# EAGLE design PCB (EAGLE 9.1.3)
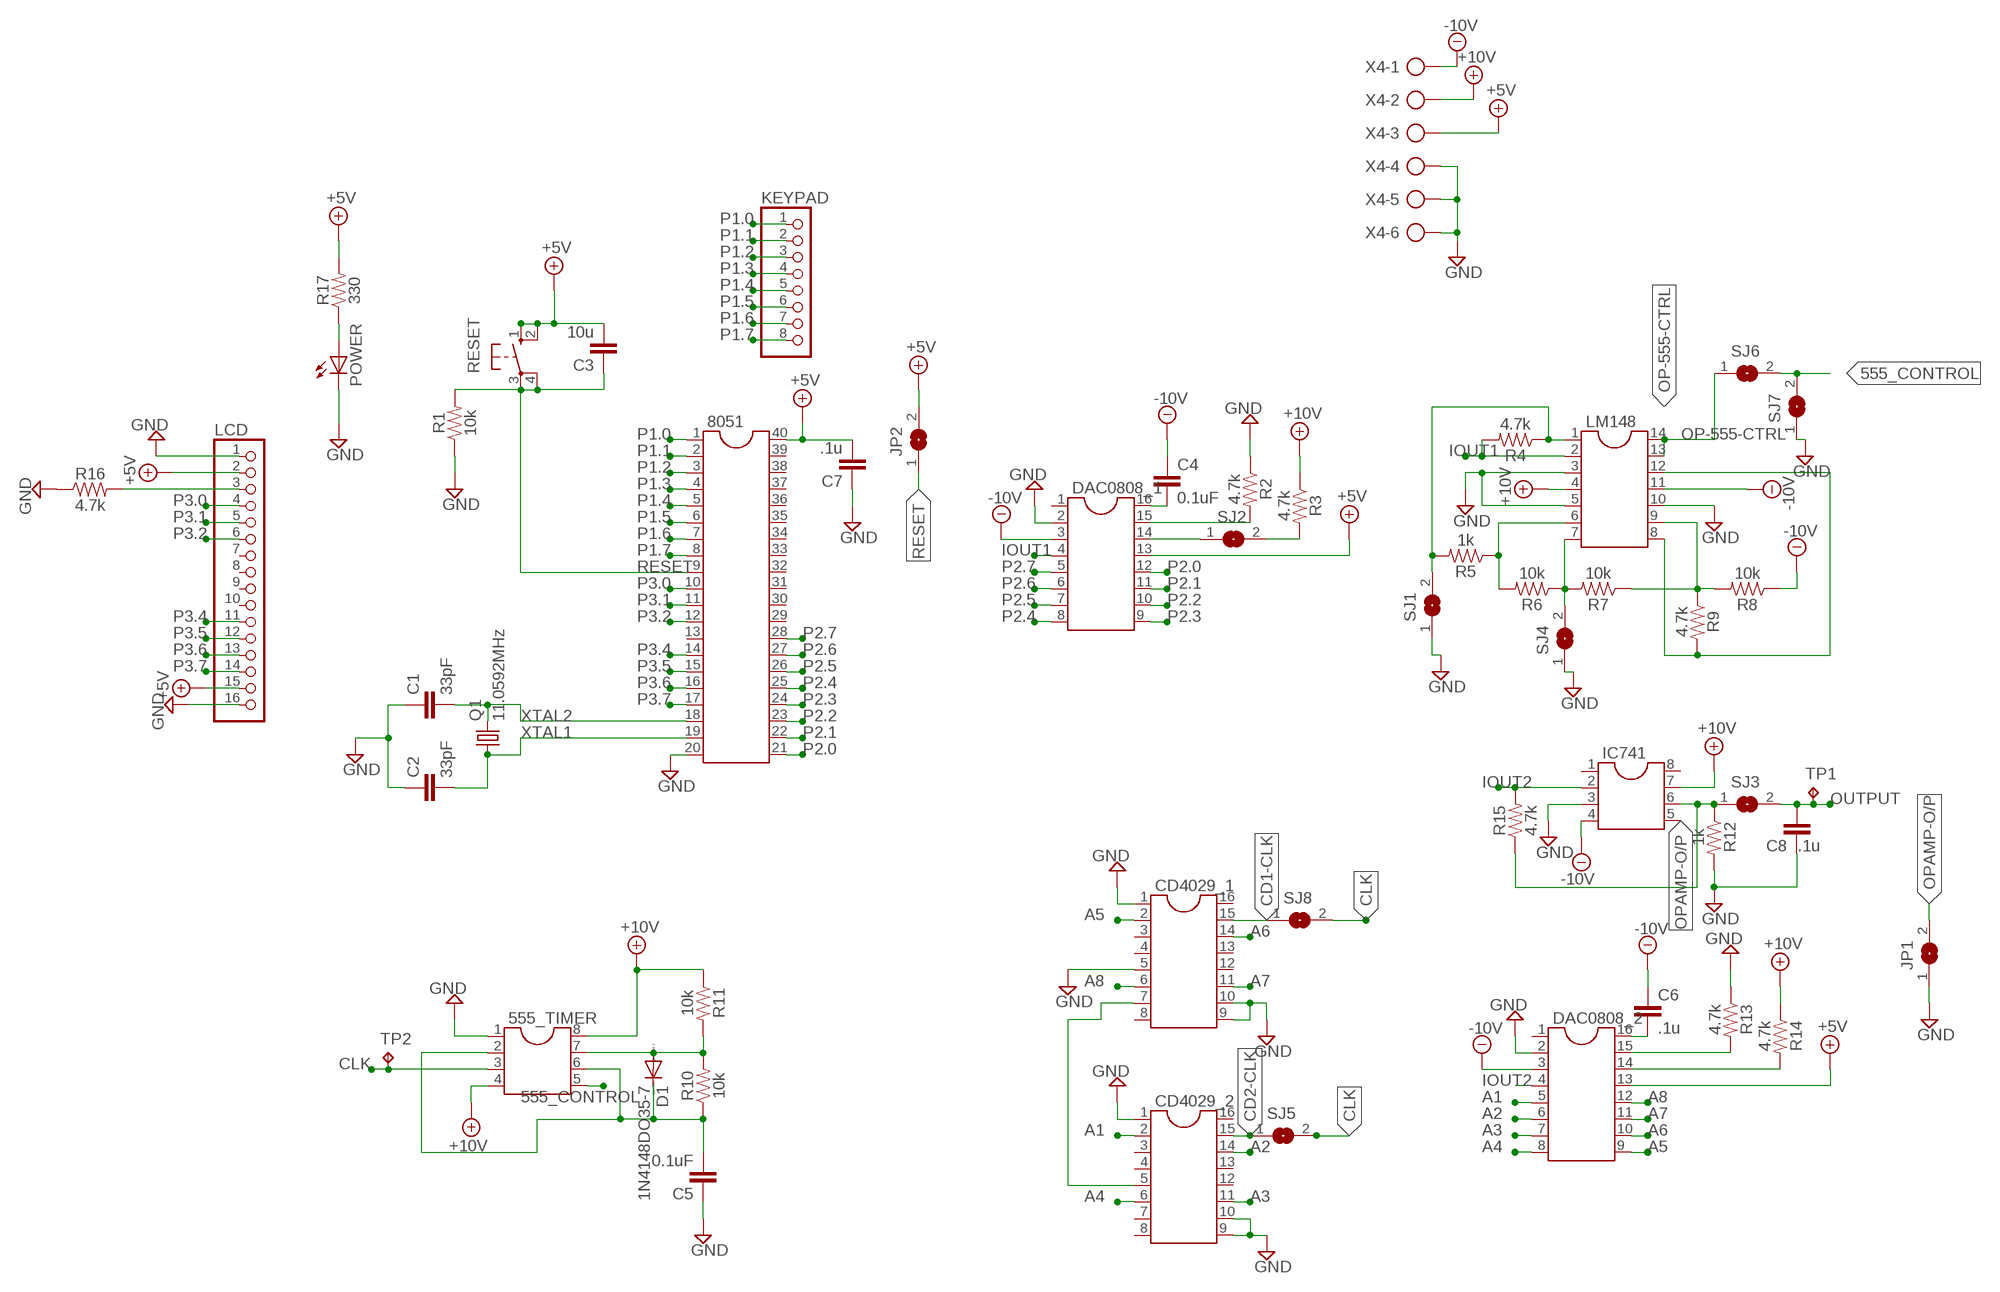
[diagram p0: schematic, sheet 1]

## Parts
555_TIMER  DIL8  [DIL08]
8051  DIL40  [DIL40]
C1  33pF  C-EU025-025X050  [C025-025X050]
C2  33pF  C-EU025-025X050  [C025-025X050]
C3  10u  C-EU025-025X050  [C025-025X050]
C4  0.1uF  C-EU025-025X050  [C025-025X050]
C5  0.1uF  C-EU025-025X050  [C025-025X050]
C6  .1u  C-EU025-025X050  [C025-025X050]
C7  .1u  C-EU025-025X050  [C025-025X050]
C8  .1u  C-EU025-025X050  [C025-025X050]
CD4029_1  DIL16  [DIL16]
CD4029_2  DIL16  [DIL16]
D1  1N4148DO35-7  [DO35-7]
DAC0808_1  DIL16  [DIL16]
DAC0808_2  DIL16  [DIL16]
IC741  DIL8  [DIL08]
JP1  SJ  [SJ]
JP2  SJ  [SJ]
KEYPAD  PINHD-1X8  [1X08]
LCD  PINHD-1X16  [1X16]
LM148  DIL14  [DIL14]
POWER  LED5MM  [LED5MM]
Q1  11.0592MHz  CRYSTALHC49S  [HC49/S]
R1  10k  RESISTORAXIAL-0.3  [AXIAL-0.3]
R2  4.7k  RESISTORAXIAL-0.3  [AXIAL-0.3]
R3  4.7k  RESISTORAXIAL-0.3  [AXIAL-0.3]
R4  4.7k  RESISTORAXIAL-0.3  [AXIAL-0.3]
R5  1k  RESISTORAXIAL-0.3  [AXIAL-0.3]
R6  10k  RESISTORAXIAL-0.3  [AXIAL-0.3]
R7  10k  RESISTORAXIAL-0.3  [AXIAL-0.3]
R8  10k  RESISTORAXIAL-0.3  [AXIAL-0.3]
R9  4.7k  RESISTORAXIAL-0.3  [AXIAL-0.3]
R10  10k  RESISTORAXIAL-0.3  [AXIAL-0.3]
R11  10k  RESISTORAXIAL-0.3  [AXIAL-0.3]
R12  1k  RESISTORAXIAL-0.3  [AXIAL-0.3]
R13  4.7k  RESISTORAXIAL-0.3  [AXIAL-0.3]
R14  4.7k  RESISTORAXIAL-0.3  [AXIAL-0.3]
R15  4.7k  RESISTORAXIAL-0.3  [AXIAL-0.3]
R16  4.7k  RESISTORAXIAL-0.3  [AXIAL-0.3]
R17  330  RESISTORAXIAL-0.3  [AXIAL-0.3]
RESET  10-XX  [B3F-10XX]
SJ1  SJ  [SJ]
SJ2  SJ  [SJ]
SJ3  SJ  [SJ]
SJ4  SJ  [SJ]
SJ5  SJ  [SJ]
SJ6  SJ  [SJ]
SJ7  SJ  [SJ]
SJ8  SJ  [SJ]
TP1  TPPAD1-20  [P1-20]
TP2  TPPAD1-20  [P1-20]
X4  AK500/6-H  [AK500/6-H]

## Nets
555_CONTROL: 555_TIMER.5 SJ6.2 SJ7.2
+5V: 8051.40 C3.2 C7.2 DAC0808_1.13 DAC0808_2.13 JP2.2 LCD.2 LCD.15 R17.P$2 RESET.1(S) RESET.2(S1) X4.3
+10V: 555_TIMER.4 555_TIMER.8 IC741.7 LM148.4 R3.P$1 R11.P$1 R14.P$1 X4.2
-10V: C4.1 C6.1 DAC0808_1.3 DAC0808_2.3 IC741.4 LM148.11 R8.P$1 X4.1
A1: CD4029_2.2 DAC0808_2.5
A2: CD4029_2.14 DAC0808_2.6
A3: CD4029_2.11 DAC0808_2.7
A4: CD4029_2.6 DAC0808_2.8
A5: CD4029_1.2 DAC0808_2.9
A6: CD4029_1.14 DAC0808_2.10
A7: CD4029_1.11 DAC0808_2.11
A8: CD4029_1.6 DAC0808_2.12
CD1-CLK: CD4029_1.15 SJ8.1
CD2-CLK: CD4029_2.15 SJ5.1
CLK: 555_TIMER.3 SJ5.2 SJ8.2 TP2.TP
GND: 555_TIMER.1 8051.20 C1.1 C2.1 C5.1 C7.1 C8.1 CD4029_1.1 CD4029_1.5 CD4029_1.9 CD4029_1.10 CD4029_2.1 CD4029_2.9 CD4029_2.10 DAC0808_1.2 DAC0808_2.2 IC741.3 JP1.1 LCD.1 LCD.16 LM148.3 LM148.5 LM148.10 POWER.K(C) R1.P$1 R2.P$1 R12.P$2 R13.P$1 R16.P$1 SJ1.1 SJ4.1 SJ7.1 X4.4 X4.5 X4.6
IOUT1: DAC0808_1.4 LM148.2 R4.P$2
IOUT2: DAC0808_2.4 IC741.2 R15.P$2
N$1: DAC0808_1.15 R2.P$2
N$2: R3.P$2 SJ2.2
N$3: C4.2 DAC0808_1.16
N$4: LM148.7 R6.P$1 R7.P$2 SJ4.2
N$5: LM148.1 R4.P$1 R5.P$2 SJ1.2
N$6: LM148.6 R5.P$1 R6.P$2
N$7: LM148.9 R7.P$1 R8.P$2 R9.P$1
N$9: 555_TIMER.7 D1.A R10.P$2 R11.P$2
N$10: 555_TIMER.2 555_TIMER.6 C5.2 D1.C R10.P$1
N$11: DAC0808_2.15 R13.P$2
N$12: DAC0808_2.14 R14.P$2
N$13: C6.2 DAC0808_2.16
N$14: CD4029_1.7 CD4029_2.5
N$15: POWER.A R17.P$1
N$16: DAC0808_1.14 SJ2.1
N$17: LM148.8 LM148.12 R9.P$2
N$33: LCD.3 R16.P$2
OP-555-CTRL: LM148.13 LM148.14 SJ6.1
OPAMP-O/P: IC741.6 JP1.2 R12.P$1 R15.P$1 SJ3.1
OUTPUT: C8.2 SJ3.2 TP1.TP
P1.0: 8051.1 KEYPAD.1
P1.1: 8051.2 KEYPAD.2
P1.2: 8051.3 KEYPAD.3
P1.3: 8051.4 KEYPAD.4
P1.4: 8051.5 KEYPAD.5
P1.5: 8051.6 KEYPAD.6
P1.6: 8051.7 KEYPAD.7
P1.7: 8051.8 KEYPAD.8
P2.0: 8051.21 DAC0808_1.12
P2.1: 8051.22 DAC0808_1.11
P2.2: 8051.23 DAC0808_1.10
P2.3: 8051.24 DAC0808_1.9
P2.4: 8051.25 DAC0808_1.8
P2.5: 8051.26 DAC0808_1.7
P2.6: 8051.27 DAC0808_1.6
P2.7: 8051.28 DAC0808_1.5
P3.0: 8051.10 LCD.4
P3.1: 8051.11 LCD.5
P3.2: 8051.12 LCD.6
P3.4: 8051.14 LCD.11
P3.5: 8051.15 LCD.12
P3.6: 8051.16 LCD.13
P3.7: 8051.17 LCD.14
RESET: 8051.9 C3.1 JP2.1 R1.P$2 RESET.3(P) RESET.4(P1)
XTAL1: 8051.19 C2.2 Q1.1
XTAL2: 8051.18 C1.2 Q1.2
Unconnected: 8051.13 8051.29 8051.30 8051.31 8051.32 8051.33 8051.34 8051.35 8051.36 8051.37 8051.38 8051.39 CD4029_1.3 CD4029_1.4 CD4029_1.8 CD4029_1.12 CD4029_1.13 CD4029_1.16 CD4029_2.3 CD4029_2.4 CD4029_2.7 CD4029_2.8 CD4029_2.12 CD4029_2.13 CD4029_2.16 DAC0808_1.1 DAC0808_2.1 IC741.1 IC741.5 IC741.8 LCD.7 LCD.8 LCD.9 LCD.10

## Library data of the parts
555_TIMER IC741 = ic-package:DIL8: Dual In Line / Socket; OC_FARNELL: unknown
8051 = ic-package:DIL40: Dual In Line; MF: OLIMEX; MPN: PIC-USB-4550; OC_FARNELL: 1701541
C1-C8 = rcl:C-EU: CAPACITOR, European symbol; OC_FARNELL: unknown; SPICEPREFIX: C
CD4029_1 CD4029_2 DAC0808_1 DAC0808_2 = ic-package:DIL16: Dual In Line / Socket; OC_FARNELL: unknown
D1 = diode:1N4148: DIODE high speed (Philips); OC_FARNELL: unknown
JP1 JP2 SJ1-SJ8 = jumper:SJ: SMD solder JUMPER; OC_FARNELL: unknown
KEYPAD = pinhead:PINHD-1X8: PIN HEADER; OC_FARNELL: unknown
LCD = pinhead:PINHD-1X16: PIN HEADER; OC_FARNELL: unknown
LM148 = ic-package:DIL14: Dual In Line / Socket; OC_FARNELL: unknown
POWER = led:LED: LED OSRAM: - CHIPLED LG R971, LG N971, LY N971, LG Q971, LY Q971, LO R971, LY R971 LH N974, LH R974 LS Q976, LO Q976, LY Q976 LO Q996 - Hyper CHIPLED LW Q18S LB Q993, LB Q99A, LB R99A - SideLED LS A670, LO A670, LY A670, LG A670, LP A670 LB A673, LV A673, LT A673, LW A673 LH A674 LY A675 LS A676, LA A676, LO A676, LY A676, LW A676 LS A679, LY A679, LG A679 - Hyper Micro SIDELED® LS Y876, LA Y876, LO Y876, LY Y876 LT Y87S - SmartLED LW L88C, LW L88S LB L89C, LB L89S, LG L890 LS L89K, LO L89K, LY L89K LS L896, LA L896, LO L896, LY L896 - TOPLED LS T670, LO T670, LY T670, LG T670, LP T670 LSG T670, LSP T670, LSY T670, LOP T670, LYG T670 LG T671, LOG T671, LSG T671 LB T673, LV T673, LT T673, LW T673 LH T674 LS T676, LA T676, LO T676, LY T676, LB T676, LH T676, LSB T676, LW T676 LB T67C, LV T67C, LT T67C, LS T67K, LO T67K, LY T67K, LW E67C LS E67B, LA E67B, LO E67B, LY E67B, LB E67C, LV E67C, LT E67C LW T67C LS T679, LY T679, LG T679 LS T770, LO T770, LY T770, LG T770, LP T770 LB T773, LV T773, LT T773, LW T773 LH T774 LS E675, LA E675, LY E675, LS T675 LS T776, LA T776, LO T776, LY T776, LB T776 LHGB T686 LT T68C, LB T68C - Hyper Mini TOPLED® LB M676 - Mini TOPLED Santana® LG M470 LS M47K, LO M47K, LY M47K Source: http://www.osram.convergy.de LUXEON: - LUMILED® LXK2-PW12-R00, LXK2-PW12-S00, LXK2-PW14-U00, LXK2-PW14-V00 LXK2-PM12-R00, LXK2-PM12-S00, LXK2-PM14-U00 LXK2-PE12-Q00, LXK2-PE12-R00, LXK2-PE12-S00, LXK2-PE14-T00, LXK2-PE14-U00 LXK2-PB12-K00, LXK2-PB12-L00, LXK2-PB12-M00, LXK2-PB14-N00, LXK2-PB14-P00, LXK2-PB14-Q00 LXK2-PR12-L00, LXK2-PR12-M00, LXK2-PR14-Q00, LXK2-PR14-R00 LXK2-PD12-Q00, LXK2-PD12-R00, LXK2-PD12-S00 LXK2-PH12-R00, LXK2-PH12-S00 LXK2-PL12-P00, LXK2-PL12-Q00, LXK2-PL12-R00 Source: www.luxeon.com KINGBRIGHT: KA-3528ASYC Source: www.kingbright.com; OC_FARNELL: unknown
Q1 = crystal:CRYSTAL: CRYSTAL; MF: MULTICOMP; MPN: HC49SM-3.6864-30-50-60-16-ATF; OC_FARNELL: 1667008; OC_NEWARK: unknown
R1-R17 = SparkFun-Resistors:RESISTOR: Generic Resistor Package; OC_FARNELL: unknown
RESET = switch-omron:10-XX: OMRON SWITCH; MF: OMRON; MPN: B3F-1000; OC_FARNELL: 176432; OC_NEWARK: 36M3542
TP1 TP2 = testpad:TP: Test pad; OC_FARNELL: unknown
X4 = con-ptr500:AK500/6-H: CONNECTOR Aug. 2004 / PTR Meßtechnik: Die Bezeichnung der Serie AK505 wurde geändert. Es handelt sich hierbei um AK500 in horizontaler Ausführung.; OC_FARNELL: unknown

## Board
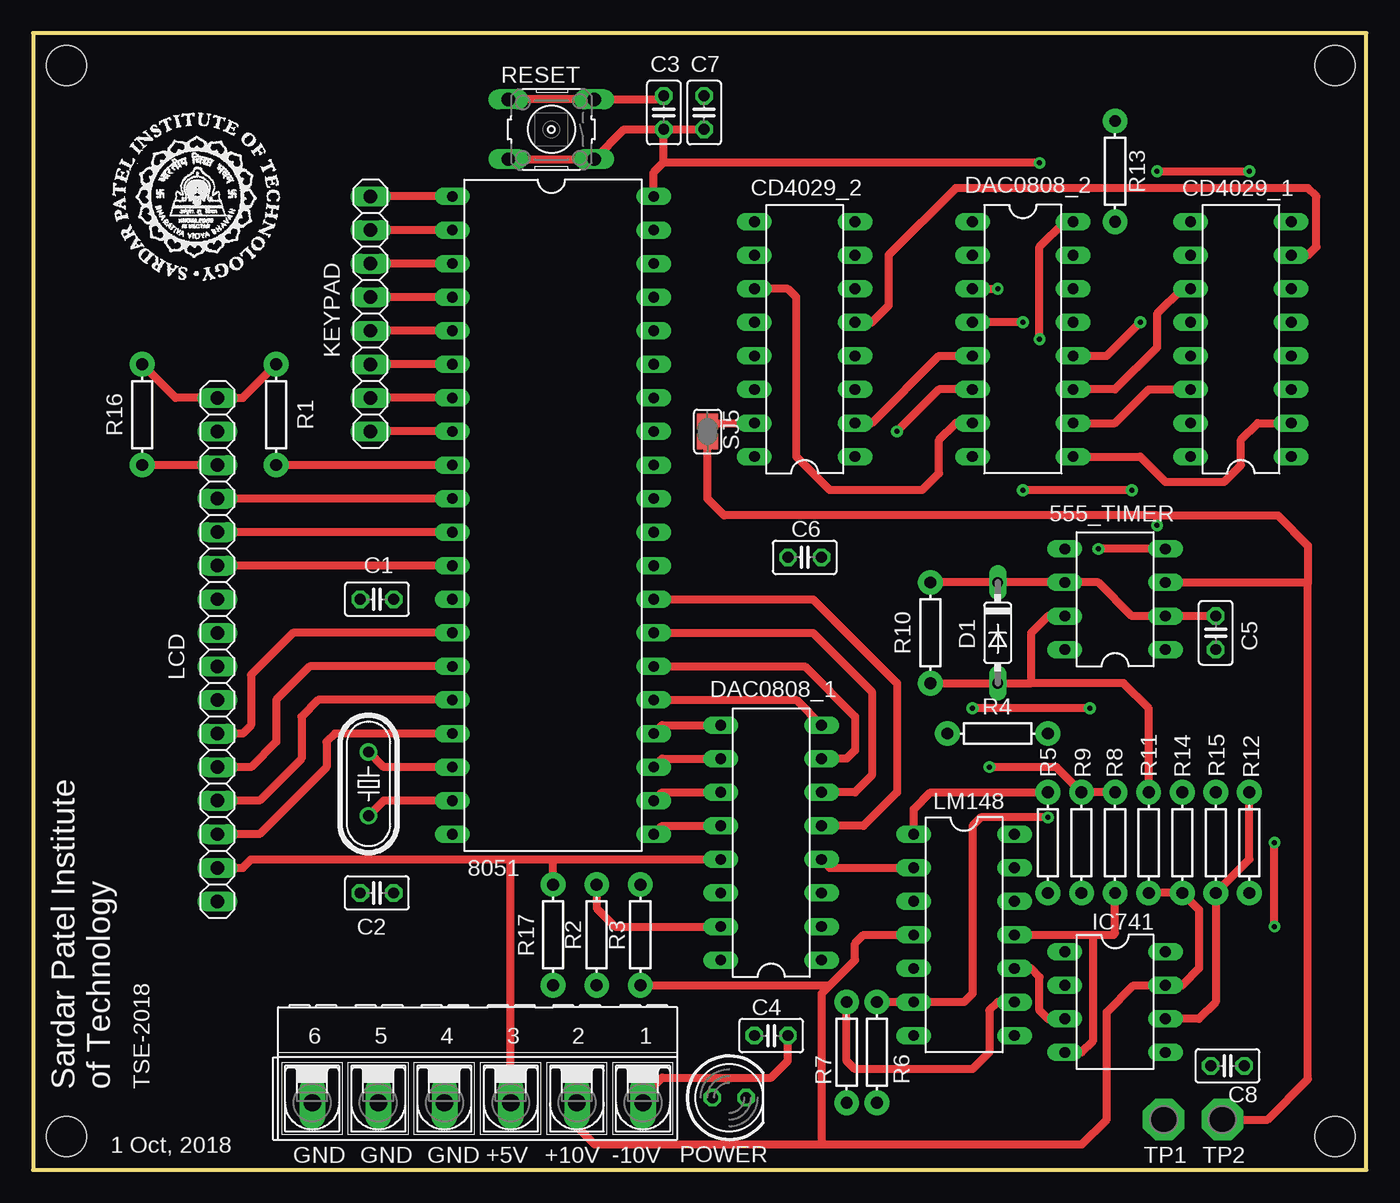
[diagram p1: board, top side]
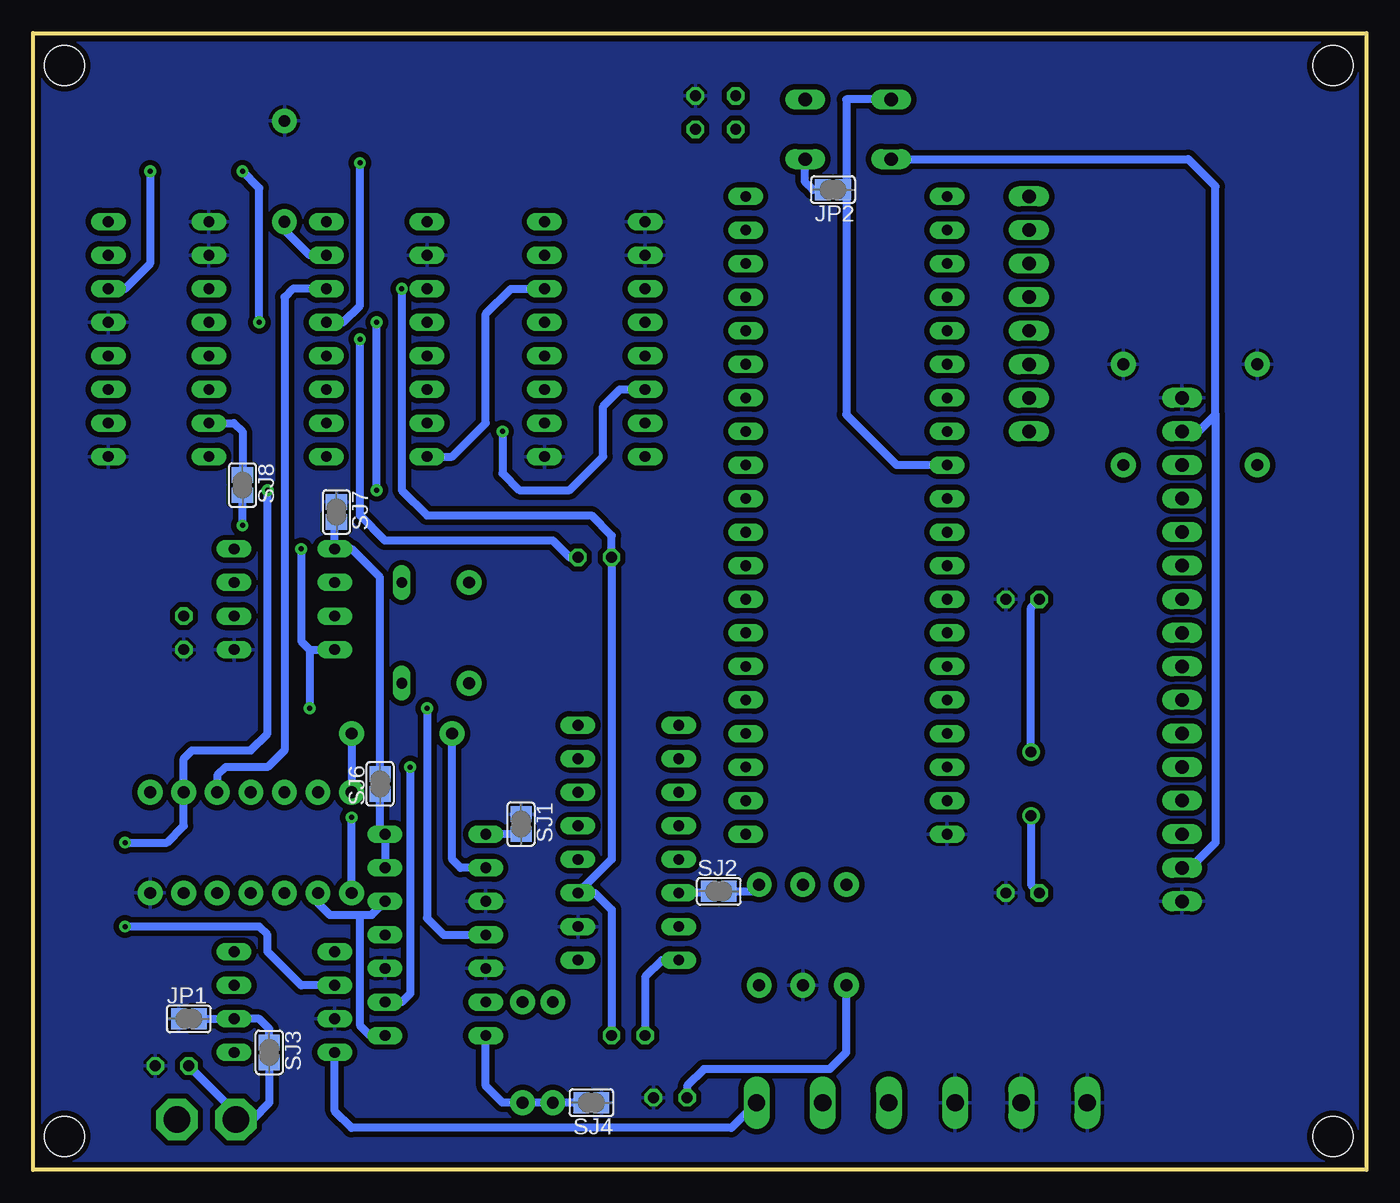
[diagram p2: board, bottom side, seen from below]

Size 100.94 x 86.03 mm. Coordinates in mm from the lower left corner, seen from the top.
Outline: 0,0 100.94,0 100.94,86.03 0,86.03 0,0
Copper layers (1*16): Top 0.035mm / dielectric 1.5mm / Bottom 0.035mm
Design rules "SparkFun-2-layer-STANDARD *": minimum track width 10mil, minimum drill 15mil, track to track 10mil, track to pad 10mil, pad to pad 10mil, via to via 10mil, smd to smd 8mil, copper to edge 8mil, drill to drill 8mil, minimum pad ring 10mil, minimum via ring 10mil, stop-mask expansion 4mil, vias tented up to drill 25mil, thermal gap 10mil
Holes 3.05 mm at 2.54,83.57 98.55,83.57 98.55,2.54 2.54,2.54

### Footprints (pad centres in the part's own frame; a part is rotated, then mirrored left to right if it is on the bottom)
DIL08 = drill 0.813 long: 1 -3.81,-3.81; 2 -1.27,-3.81; 3 1.27,-3.81; 4 3.81,-3.81; 5 3.81,3.81; 6 1.27,3.81; 7 -1.27,3.81; 8 -3.81,3.81
DIL40 = drill 0.813 long: 1 -24.13,-7.62; 2 -21.59,-7.62; 3 -19.05,-7.62; 4 -16.51,-7.62; 5 -13.97,-7.62; 6 -11.43,-7.62; 7 -8.89,-7.62; 8 -6.35,-7.62; 9 -3.81,-7.62; 10 -1.27,-7.62; 11 1.27,-7.62; 12 3.81,-7.62; 13 6.35,-7.62; 14 8.89,-7.62; 15 11.43,-7.62; 16 13.97,-7.62; 17 16.51,-7.62; 18 19.05,-7.62; 19 21.59,-7.62; 20 24.13,-7.62; 21 24.13,7.62; 22 21.59,7.62; 23 19.05,7.62; 24 16.51,7.62; 25 13.97,7.62; 26 11.43,7.62; 27 8.89,7.62; 28 6.35,7.62; 29 3.81,7.62; 30 1.27,7.62; 31 -1.27,7.62; 32 -3.81,7.62; 33 -6.35,7.62; 34 -8.89,7.62; 35 -11.43,7.62; 36 -13.97,7.62; 37 -16.51,7.62; 38 -19.05,7.62; 39 -21.59,7.62; 40 -24.13,7.62
C025-025X050 = drill 0.813 octagon: 1 -1.27,0; 2 1.27,0
DIL16 = drill 0.813 long: 1 -8.89,-3.81; 2 -6.35,-3.81; 3 -3.81,-3.81; 4 -1.27,-3.81; 5 1.27,-3.81; 6 3.81,-3.81; 7 6.35,-3.81; 8 8.89,-3.81; 9 8.89,3.81; 10 6.35,3.81; 11 3.81,3.81; 12 1.27,3.81; 13 -1.27,3.81; 14 -3.81,3.81; 15 -6.35,3.81; 16 -8.89,3.81
DO35-7 = drill 0.813 long: A 3.81,0; C -3.81,0
SJ = smd 1.168 x 1.6: 1 -0.762,0; 2 0.762,0
1X08 = drill 1.016 long: 1 -8.89,0; 2 -6.35,0; 3 -3.81,0; 4 -1.27,0; 5 1.27,0; 6 3.81,0; 7 6.35,0; 8 8.89,0
1X16 = drill 1.016 long: 1 -19.05,0; 2 -16.51,0; 3 -13.97,0; 4 -11.43,0; 5 -8.89,0; 6 -6.35,0; 7 -3.81,0; 8 -1.27,0; 9 1.27,0; 10 3.81,0; 11 6.35,0; 12 8.89,0; 13 11.43,0; 14 13.97,0; 15 16.51,0; 16 19.05,0
DIL14 = drill 0.813 long: 1 -7.62,-3.81; 2 -5.08,-3.81; 3 -2.54,-3.81; 4 0,-3.81; 5 2.54,-3.81; 6 5.08,-3.81; 7 7.62,-3.81; 8 7.62,3.81; 9 5.08,3.81; 10 2.54,3.81; 11 0,3.81; 12 -2.54,3.81; 13 -5.08,3.81; 14 -7.62,3.81
LED5MM = drill 0.813 octagon: A -1.27,0; K 1.27,0
HC49/S = drill 0.813: 1 -2.413,0; 2 2.413,0
AXIAL-0.3 = drill 0.9 pad 1.88: P$1 -3.81,0; P$2 3.81,0
B3F-10XX = drill 1.016 long: 1 -3.251,2.261; 2 3.251,2.261; 3 -3.251,-2.261; 4 3.251,-2.261
P1-20 = drill 2.007 pad 3.15 octagon: TP 0,0
AK500/6-H = drill 1.321 long: 1 -12.522,0; 2 -7.518,0; 3 -2.515,0; 4 2.515,0; 5 7.518,0; 6 12.522,0

### Placement (x,y rotation side)
555_TIMER  81.91,43.18 90 top
8051  39.37,49.53 270 top
C1  26.04,43.18 180 top
C2  26.04,20.95 180 top
C3  47.75,80.01 270 top
C4  55.88,10.16 180 top
C5  89.53,40.64 90 top
C6  58.42,46.35 0 top
C7  50.8,80.01 270 top
C8  90.42,7.87 180 top
CD4029_1  91.44,62.87 90 top
CD4029_2  58.42,62.87 90 top
D1  73.03,40.64 270 top
DAC0808_1  55.88,24.77 90 top
DAC0808_2  74.93,62.87 270 top
IC741  81.91,12.7 270 top
JP1  89.15,11.43 0 bottom
JP2  40.39,74.17 180 bottom
KEYPAD  25.55,64.77 270 top
LCD  13.97,39.37 270 top
LM148  70.49,17.78 270 top
POWER  52.71,5.46 0 top
Q1  25.4,29.21 90 top
R1  18.41,57.15 270 top
R2  42.67,17.78 90 top
R3  45.97,17.78 90 top
R4  73.03,33.02 180 top
R5  76.84,24.77 90 top
R6  63.88,8.89 90 top
R7  61.6,8.89 270 top
R8  81.91,24.77 90 top
R9  79.38,24.77 270 top
R10  67.94,40.64 270 top
R11  84.46,24.77 90 top
R12  92.07,24.77 270 top
R13  81.91,75.56 270 top
R14  87,24.77 90 top
R15  89.53,24.77 90 top
R16  8.26,57.15 270 top
R17  39.37,17.78 90 top
RESET  39.24,78.74 180 top
SJ1  64.01,26.16 270 bottom
SJ2  49.02,21.08 0 bottom
SJ3  83.06,8.89 270 bottom
SJ4  58.67,5.08 180 bottom
SJ5  51.05,55.88 270 top
SJ6  74.68,29.21 90 bottom
SJ7  77.98,49.78 270 bottom
SJ8  85.09,51.82 270 bottom
TP1  85.6,3.81 270 top
TP2  90.04,3.81 270 top
X4  33.66,5.08 180 top

### Tracks (layer width: path | path; a pad name or v marks a point on that pad's centre or on a via)
555_CONTROL
  Bottom 0.61: SJ6.2 74.68,44.83 76.84,46.99 555_TIMER.5 78.1,48.9 SJ7.2
+5V  (via drill 0.38)
  Top 0.61: RESET.2 RESET.1 44.76,78.74 C3.2 | 8051.40 46.99,75.49 47.7,76.2 | 36.2,23.5 39.37,23.5 | 39.37,23.5 DAC0808_1.13 | 36.2,23.5 16.51,23.5 15.88,22.86 LCD.15 | C3.2 C7.2 | X4.3 36.17,23.47 36.2,23.5 | R17.P$2 39.37,23.5 | v76.2,76.2 47.7,76.2 | C3.2 47.7,78.69 47.7,76.2
  Bottom 0.61: LCD.2 12.7,55.88 11.43,57.15 | DAC0808_2.13 77.47,64.14 76.2,65.41 v76.2,76.2 | 11.43,57.15 11.43,74.42 13.49,76.48 RESET.2 | 11.43,57.15 11.43,24.77 13.34,22.86 LCD.15 | JP2.2 41.91,74.17 42.49,74.75 RESET.1
+10V  (via drill 0.38)
  Top 0.61: 555_TIMER.4 v80.65,46.99 | v80.01,34.92 v71.12,34.92 | LM148.4 62.87,17.78 62.23,17.14 62.23,15.88 60.32,13.97 | R11.P$1 R14.P$1 88.27,19.68 88.27,15.24 87,13.97 IC741.7 83.31,13.97 81.28,11.94 81.28,3.81 79.38,1.91 59.69,1.91 | X4.2 41.17,3.28 42.55,1.91 59.69,1.91 | R3.P$1 60.32,13.97 | 59.69,1.91 59.69,13.34 60.32,13.97
  Bottom 0.61: v80.65,46.99 80.65,40.01 80.01,39.37 | 80.01,39.37 555_TIMER.8 | 80.01,39.37 v80.01,34.92 | v71.12,34.92 71.12,19.05 69.85,17.78 LM148.4
-10V  (via drill 0.38)
  Top 0.61: DAC0808_2.3 v73.03,66.67 | IC741.4 79.38,8.89 80.26,9.78 80.26,17.78 | C4.1 57.15,8.26 55.88,6.99 47.63,6.99 46.18,5.54 X4.1 | LM148.11 80.26,17.78 | 80.26,17.78 81.79,17.78 81.91,17.91 R8.P$1
  Bottom 0.61: v73.03,66.67 73.03,51.44 71.12,49.53 58.67,49.53 57.15,48.01 C6.1 57.15,23.5 DAC0808_1.3 58.42,20.95 57.15,19.68 C4.1 | X4.1 48.08,3.17 76.84,3.17 78.1,4.45 IC741.4
A1
  Top 0.61: CD4029_2.2 63.5,56.52 68.58,61.59 DAC0808_2.5
A2  (via drill 0.38)
  Top 0.61: DAC0808_2.6 68.58,59.05 v65.41,55.88
  Bottom 0.61: v65.41,55.88 65.41,52.7 64.13,51.44 60.32,51.44 57.79,53.98 57.79,57.78 56.52,59.05 CD4029_2.14
A3
  Top 0.61: DAC0808_2.7 69.85,56.52 68.58,55.24 68.58,52.7 67.31,51.44 60.32,51.44 57.79,53.98 57.79,66.04 57.15,66.67 CD4029_2.11
A4
  Bottom 0.61: DAC0808_2.8 69.22,53.98 66.68,56.52 66.68,64.77 64.77,66.67 CD4029_2.6
A5
  Top 0.61: DAC0808_2.9 83.82,53.98 85.72,52.07 90.17,52.07 91.44,53.34 91.44,55.24 92.71,56.52 CD4029_1.2
A6
  Top 0.61: DAC0808_2.10 81.91,56.52 84.46,59.05 CD4029_1.14
A7
  Top 0.61: CD4029_1.11 87,66.67 85.09,64.77 85.09,62.23 81.91,59.05 DAC0808_2.11
A8  (via drill 0.38)
  Top 0.61: DAC0808_2.12 81.28,61.59 v83.82,64.14 | v85.09,75.56 v92.07,75.56
  Bottom 0.61: v83.82,64.14 83.82,74.3 v85.09,75.56 | v92.07,75.56 92.07,68.58 93.98,66.67 CD4029_1.6
CD1-CLK
  Bottom 0.61: SJ8.1 85.09,55.88 85.72,56.52 CD4029_1.15
CD2-CLK
  Top 0.61: SJ5.1 51.18,56.52 CD4029_2.15
CLK  (via drill 0.38)
  Top 0.61: 85.09,49.53 94.23,49.53 96.52,47.24 96.52,44.45 | 555_TIMER.3 96.52,44.45 | TP2.TP 93.47,3.81 96.52,6.86 96.52,44.45 | SJ5.2 51.05,50.8 52.32,49.53 85.09,49.53 | 85.09,49.53 v85.09,48.77
  Bottom 0.61: v85.09,48.77 SJ8.2
GND
  Top 0.61: R16.P$1 10.8,58.42 LCD.1 15.88,58.42 R1.P$1 | IC741.3 76.84,11.43 76.2,12.06 76.2,14.61 75.56,15.24 LM148.10
  pour Bottom (isolate 0.406): 0.64,85.47 100.46,85.47 100.46,0.64 0.64,0.64
IOUT1
  Top 0.61: DAC0808_1.4 60.32,22.86 LM148.2
  Bottom 0.61: R4.P$2 69.22,23.5 68.58,22.86 LM148.2
IOUT2  (via drill 0.38)
  Top 0.61: v83.19,51.44 v74.93,51.44 | v74.93,64.14 DAC0808_2.4 | v93.98,18.41 v93.98,24.77
  Bottom 0.61: v74.93,51.44 v74.93,64.14 | v83.19,51.44 83.19,33.02 84.46,31.75 88.9,31.75 89.53,31.11 R15.P$2 89.53,26.04 90.81,24.77 v93.98,24.77 | IC741.2 80.65,13.97 83.19,16.51 83.19,17.78 83.82,18.41 v93.98,18.41
N$1
  Top 0.61: DAC0808_1.15 44.07,18.41 42.67,19.81 R2.P$2
N$2
  Bottom 0.61: SJ2.2 46.48,21.08 R3.P$2
N$3
  Bottom 0.61: DAC0808_1.16 53.34,15.88 54.61,14.61 C4.2
N$4
  Bottom 0.61: LM148.7 66.68,6.35 65.41,5.08 R6.P$1 R7.P$2 SJ4.2
N$5
  Top 0.61: R5.P$2 67.94,28.57 66.68,27.3 LM148.1
  Bottom 0.61: R4.P$1 R5.P$2 | SJ1.2 LM148.1
N$6  (via drill 0.38)
  Top 0.61: v76.84,26.67 71.75,26.67 71.12,26.04 71.12,13.34 70.49,12.7 LM148.6 R6.P$2
  Bottom 0.61: R5.P$1 v76.84,26.67
N$7  (via drill 0.38)
  Top 0.61: R8.P$2 R9.P$1 77.47,30.48 v72.39,30.48 | LM148.9 73.03,12.7 72.39,12.06 72.39,8.89 71.12,7.62 62.23,7.62 61.6,8.26 R7.P$1
  Bottom 0.61: v72.39,30.48 72.39,13.34 73.03,12.7 LM148.9
N$9
  Top 0.61: R10.P$2 D1.A 75.56,36.83 | 75.56,36.83 75.56,40.64 76.84,41.91 555_TIMER.7 | R11.P$2 84.46,34.92 82.55,36.83 75.56,36.83
N$10
  Top 0.61: C5.2 555_TIMER.2 83.19,41.91 80.65,44.45 555_TIMER.6 D1.C R10.P$1
N$11
  Bottom 0.61: DAC0808_2.15 80.01,69.22 81.91,71.12 R13.P$2
N$12
  Bottom 0.61: DAC0808_2.14 81.28,66.67 81.91,66.04 81.91,31.75 83.19,30.48 86.36,30.48 87,29.84 R14.P$2
N$13  (via drill 0.38)
  Top 0.61: v76.2,62.87 76.2,69.85 78.1,71.75 DAC0808_2.16
  Bottom 0.61: v76.2,62.87 76.2,49.53 74.3,47.62 61.6,47.62 60.32,46.35 C6.2
N$14
  Top 0.61: CD4029_1.7 96.52,69.22 97.16,69.85 97.16,73.66 96.52,74.3 69.85,74.3 64.77,69.22 64.77,65.41 63.5,64.14 CD4029_2.5
N$15
  Bottom 0.61: R17.P$1 39.37,8.89 40.64,7.62 50.16,7.62 51.44,6.35 POWER.A
N$16
  Bottom 0.61: SJ2.1 49.91,20.95 DAC0808_1.14
N$17
  Bottom 0.61: LM148.8 75.44,10.16 76.18,10.9 76.18,19.28 76.2,19.3 | LM148.12 75.31,19.3 76.2,19.3 | 76.2,19.3 78.49,19.3 79.38,20.19 R9.P$2
N$33
  Top 0.61: LCD.3 R16.P$2
OP-555-CTRL
  Bottom 0.61: SJ6.1 74.68,25.78 LM148.14 LM148.13
OPAMP-O/P
  Top 0.61: IC741.6 88.27,11.43 89.53,12.7 R15.P$1 92.07,23.5 R12.P$1
  Bottom 0.61: SJ3.1 83.06,10.67 83.82,11.43 IC741.6 JP1.2
OUTPUT
  Bottom 0.61: SJ3.2 83.06,5.08 84.33,3.81 TP1.TP 85.6,4.32 C8.2
P1.0
  Top 0.61: 8051.1 KEYPAD.1
P1.1
  Top 0.61: 8051.2 KEYPAD.2
P1.2
  Top 0.61: 8051.3 KEYPAD.3
P1.3
  Top 0.61: 8051.4 KEYPAD.4
P1.4
  Top 0.61: 8051.5 KEYPAD.5
P1.5
  Top 0.61: 8051.6 KEYPAD.6
P1.6
  Top 0.61: 8051.7 KEYPAD.7
P1.7
  Top 0.61: 8051.8 KEYPAD.8
P2.0
  Top 0.61: DAC0808_1.12 47.63,26.04 8051.21
P2.1
  Top 0.61: DAC0808_1.11 47.63,28.57 8051.22
P2.2
  Top 0.61: DAC0808_1.10 47.63,31.11 8051.23
P2.3
  Top 0.61: DAC0808_1.9 47.63,33.66 8051.24
P2.4
  Top 0.61: 8051.25 57.79,35.56 DAC0808_1.8
P2.5
  Top 0.61: 8051.26 58.42,38.1 62.23,34.29 62.23,31.75 61.6,31.11 DAC0808_1.7
P2.6
  Top 0.61: 8051.27 59.05,40.64 63.5,36.2 63.5,29.84 62.23,28.57 DAC0808_1.6
P2.7
  Top 0.61: 8051.28 59.05,43.18 65.41,36.83 65.41,28.57 62.87,26.04 DAC0808_1.5
P3.0
  Top 0.61: 8051.10 LCD.4
P3.1
  Top 0.61: 8051.11 LCD.5
P3.2
  Top 0.61: 8051.12 LCD.6
P3.4
  Top 0.61: 8051.14 19.69,40.64 16.51,37.47 16.51,33.66 15.88,33.02 LCD.11
P3.5
  Top 0.61: LCD.12 16.51,30.48 18.41,32.38 18.41,35.56 20.96,38.1 8051.15
P3.6
  Top 0.61: 8051.16 21.59,35.56 20.32,34.29 20.32,31.11 17.15,27.94 LCD.13
P3.7
  Top 0.61: 8051.17 22.86,33.02 22.23,32.38 22.23,30.48 17.15,25.4 LCD.14
RESET
  Top 0.61: 8051.9 R1.P$2 | RESET.4 RESET.3 47.47,81 C3.1
  Bottom 0.61: 8051.9 35.56,53.34 39.37,57.15 39.37,74.17 | RESET.4 39.37,81 39.37,74.17 | JP2.1 39.37,74.17
XTAL1
  Top 0.61: 8051.19 26.54,27.94 Q1.1
  Bottom 0.61: Q1.1 25.4,21.59 C2.2
XTAL2
  Top 0.61: Q1.2 26.54,30.48 8051.18
  Bottom 0.61: Q1.2 25.4,42.55 C1.2

### Text on the board
tPlace: Sardar Patel Institute / of Technology | TSE-2018 | 1 Oct, 2018 | GND | GND | GND | +5V | +10V | -10V